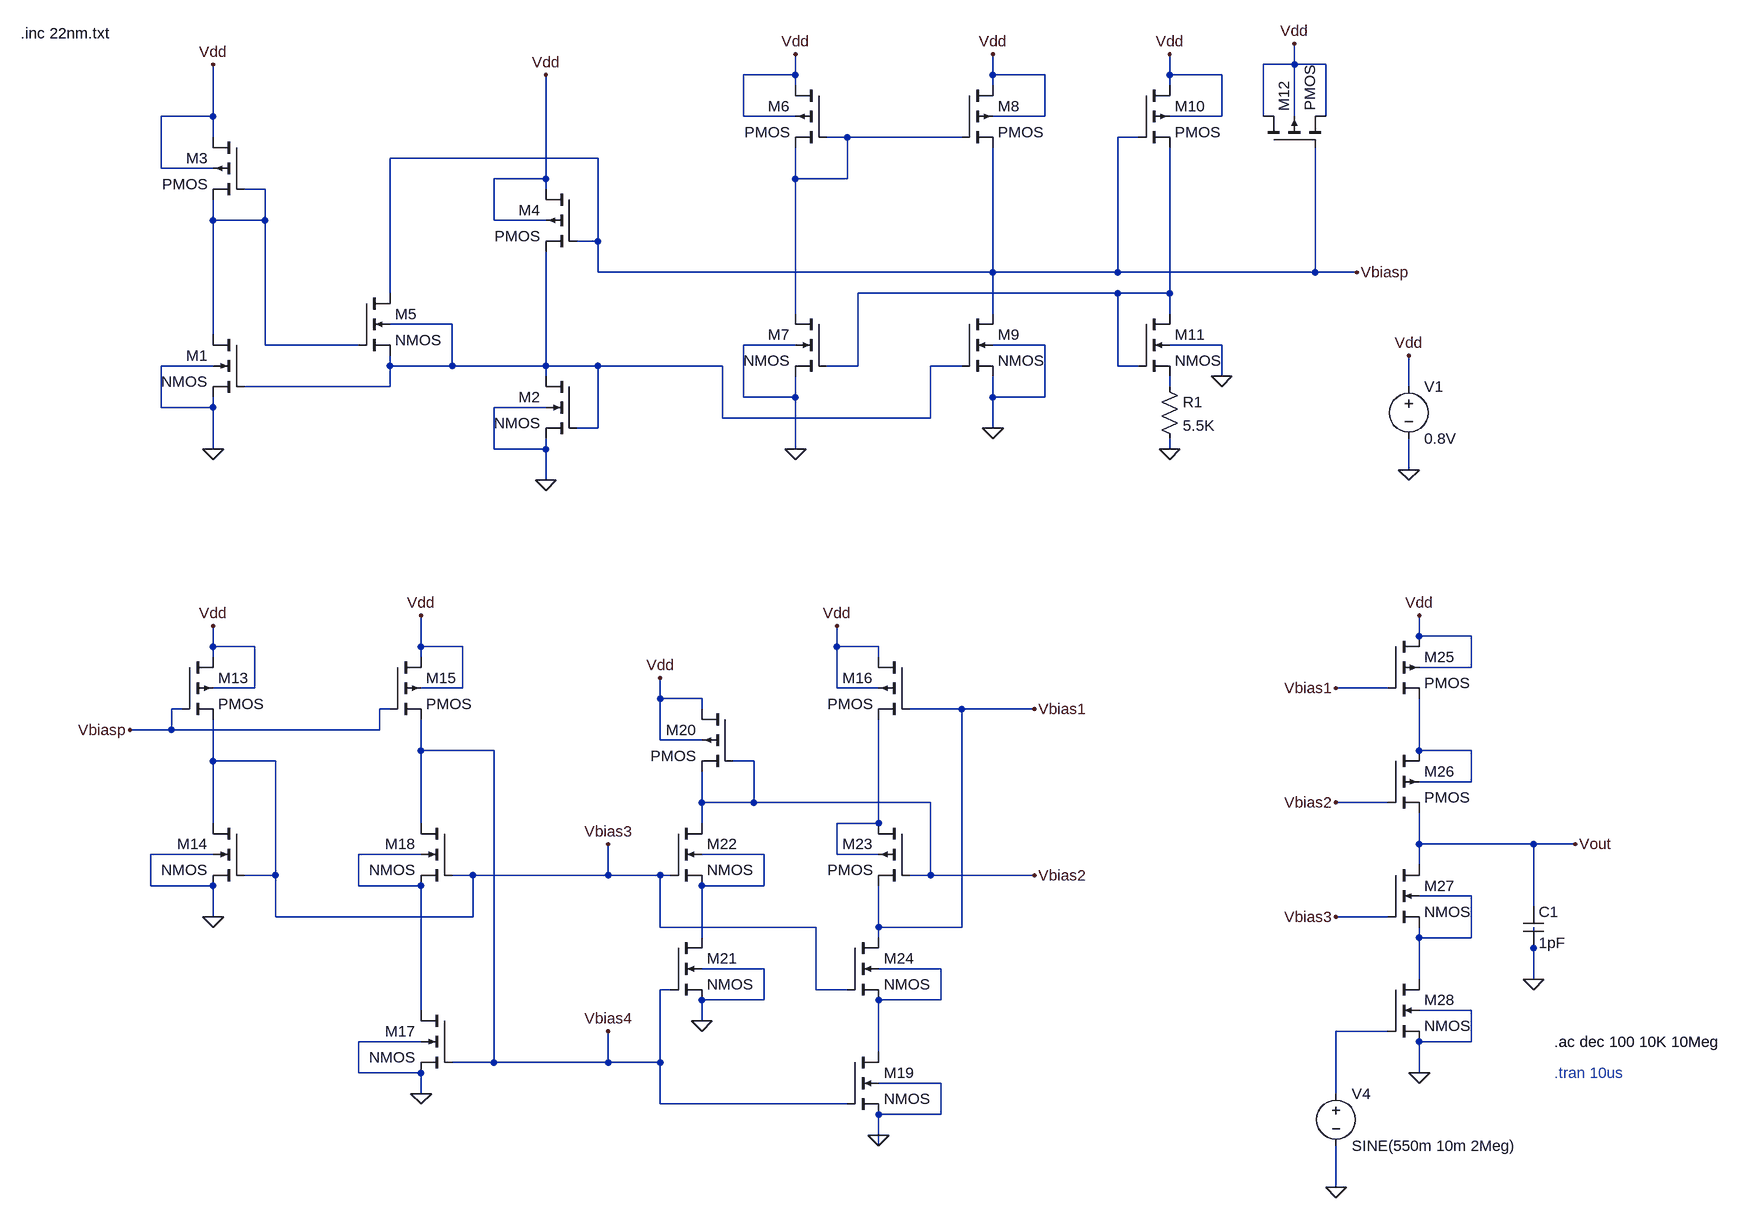
[diagram p0: schematic 22nm_schematic.asc]
22nm_schematic.asc, the LTspice schematic file:
Version 4
SHEET 1 2888 1620
WIRE -864 -128 -864 -160
WIRE -864 -128 -912 -128
WIRE -816 -128 -864 -128
WIRE -1632 -112 -1632 -144
WIRE -1632 -112 -1712 -112
WIRE -1328 -112 -1328 -144
WIRE -1248 -112 -1328 -112
WIRE -1056 -112 -1056 -144
WIRE -976 -112 -1056 -112
WIRE -1632 -96 -1632 -112
WIRE -1328 -96 -1328 -112
WIRE -1056 -96 -1056 -112
WIRE -2528 -48 -2528 -128
WIRE -2528 -48 -2608 -48
WIRE -1712 -48 -1712 -112
WIRE -1632 -48 -1712 -48
WIRE -1248 -48 -1248 -112
WIRE -1248 -48 -1328 -48
WIRE -976 -48 -976 -112
WIRE -976 -48 -1056 -48
WIRE -912 -48 -912 -128
WIRE -864 -48 -864 -128
WIRE -816 -48 -816 -128
WIRE -2528 -16 -2528 -48
WIRE -1552 -16 -1584 -16
WIRE -1376 -16 -1552 -16
WIRE -1104 -16 -1136 -16
WIRE -1936 16 -2256 16
WIRE -2608 32 -2608 -48
WIRE -2528 32 -2608 32
WIRE -2016 48 -2016 -112
WIRE -2016 48 -2096 48
WIRE -1632 48 -1632 0
WIRE -1552 48 -1552 -16
WIRE -1552 48 -1632 48
WIRE -2448 64 -2480 64
WIRE -2016 64 -2016 48
WIRE -2528 112 -2528 80
WIRE -2448 112 -2448 64
WIRE -2448 112 -2528 112
WIRE -2096 112 -2096 48
WIRE -2016 112 -2096 112
WIRE -1936 144 -1936 16
WIRE -1936 144 -1968 144
WIRE -1936 192 -1936 144
WIRE -1328 192 -1328 0
WIRE -1328 192 -1936 192
WIRE -1136 192 -1136 -16
WIRE -1136 192 -1328 192
WIRE -832 192 -832 0
WIRE -832 192 -1136 192
WIRE -768 192 -832 192
WIRE -2256 224 -2256 16
WIRE -1136 224 -1536 224
WIRE -1056 224 -1056 0
WIRE -1056 224 -1136 224
WIRE -1632 256 -1632 48
WIRE -1328 256 -1328 192
WIRE -1056 256 -1056 224
WIRE -2160 272 -2256 272
WIRE -2528 288 -2528 112
WIRE -2448 304 -2448 112
WIRE -2304 304 -2448 304
WIRE -1632 304 -1712 304
WIRE -1248 304 -1328 304
WIRE -976 304 -1056 304
WIRE -2528 336 -2608 336
WIRE -2256 336 -2256 320
WIRE -2160 336 -2160 272
WIRE -2160 336 -2256 336
WIRE -2016 336 -2016 160
WIRE -2016 336 -2160 336
WIRE -1936 336 -2016 336
WIRE -1744 336 -1936 336
WIRE -1536 336 -1536 224
WIRE -1536 336 -1584 336
WIRE -1376 336 -1424 336
WIRE -1136 336 -1136 224
WIRE -1104 336 -1136 336
WIRE -2016 352 -2016 336
WIRE -976 352 -976 304
WIRE -2256 368 -2256 336
WIRE -2256 368 -2480 368
WIRE -1056 368 -1056 352
WIRE -688 368 -688 320
WIRE -1712 384 -1712 304
WIRE -1632 384 -1632 352
WIRE -1632 384 -1712 384
WIRE -1328 384 -1328 352
WIRE -1248 384 -1248 304
WIRE -1248 384 -1328 384
WIRE -2608 400 -2608 336
WIRE -2528 400 -2528 384
WIRE -2528 400 -2608 400
WIRE -2016 400 -2096 400
WIRE -1744 416 -1744 336
WIRE -1424 416 -1424 336
WIRE -1424 416 -1744 416
WIRE -1936 432 -1936 336
WIRE -1936 432 -1968 432
WIRE -1328 432 -1328 384
WIRE -2528 464 -2528 400
WIRE -2096 464 -2096 400
WIRE -2016 464 -2016 448
WIRE -2016 464 -2096 464
WIRE -1632 464 -1632 384
WIRE -1056 464 -1056 448
WIRE -688 496 -688 448
WIRE -2016 512 -2016 464
WIRE -672 752 -672 720
WIRE -592 752 -672 752
WIRE -2528 768 -2528 736
WIRE -2464 768 -2528 768
WIRE -2208 768 -2208 720
WIRE -2144 768 -2208 768
WIRE -1568 768 -1568 736
WIRE -1504 768 -1568 768
WIRE -2528 784 -2528 768
WIRE -2208 784 -2208 768
WIRE -1504 784 -1504 768
WIRE -592 800 -592 752
WIRE -592 800 -672 800
WIRE -2464 832 -2464 768
WIRE -2464 832 -2528 832
WIRE -2144 832 -2144 768
WIRE -2144 832 -2208 832
WIRE -1568 832 -1568 768
WIRE -1504 832 -1568 832
WIRE -720 832 -800 832
WIRE -1840 848 -1840 816
WIRE -1776 848 -1840 848
WIRE -2576 864 -2592 864
WIRE -2256 864 -2272 864
WIRE -1776 864 -1776 848
WIRE -1376 864 -1456 864
WIRE -1264 864 -1376 864
WIRE -2592 896 -2592 864
WIRE -2592 896 -2656 896
WIRE -2272 896 -2272 864
WIRE -2272 896 -2592 896
WIRE -1840 912 -1840 848
WIRE -1776 912 -1840 912
WIRE -2208 928 -2208 880
WIRE -2096 928 -2208 928
WIRE -672 928 -672 848
WIRE -592 928 -672 928
WIRE -2528 944 -2528 880
WIRE -2432 944 -2528 944
WIRE -1696 944 -1728 944
WIRE -592 976 -592 928
WIRE -592 976 -672 976
WIRE -1776 1008 -1776 960
WIRE -1696 1008 -1696 944
WIRE -1696 1008 -1776 1008
WIRE -1424 1008 -1696 1008
WIRE -720 1008 -800 1008
WIRE -2528 1040 -2528 944
WIRE -2208 1040 -2208 928
WIRE -1776 1040 -1776 1008
WIRE -1504 1040 -1504 880
WIRE -1504 1040 -1568 1040
WIRE -672 1072 -672 1024
WIRE -496 1072 -672 1072
WIRE -432 1072 -496 1072
WIRE -2528 1088 -2624 1088
WIRE -2208 1088 -2304 1088
WIRE -1680 1088 -1776 1088
WIRE -1568 1088 -1568 1040
WIRE -1504 1088 -1568 1088
WIRE -672 1104 -672 1072
WIRE -2432 1120 -2432 944
WIRE -2432 1120 -2480 1120
WIRE -2128 1120 -2160 1120
WIRE -1920 1120 -1920 1072
WIRE -1920 1120 -2128 1120
WIRE -1840 1120 -1920 1120
WIRE -1824 1120 -1840 1120
WIRE -1424 1120 -1424 1008
WIRE -1424 1120 -1456 1120
WIRE -1264 1120 -1424 1120
WIRE -2624 1136 -2624 1088
WIRE -2528 1136 -2624 1136
WIRE -2304 1136 -2304 1088
WIRE -2208 1136 -2304 1136
WIRE -1680 1136 -1680 1088
WIRE -1680 1136 -1776 1136
WIRE -592 1152 -672 1152
WIRE -496 1168 -496 1072
WIRE -2528 1184 -2528 1136
WIRE -2432 1184 -2432 1120
WIRE -2128 1184 -2128 1120
WIRE -2128 1184 -2432 1184
WIRE -720 1184 -800 1184
WIRE -1840 1200 -1840 1120
WIRE -1600 1200 -1840 1200
WIRE -1504 1200 -1504 1136
WIRE -1376 1200 -1376 864
WIRE -1376 1200 -1504 1200
WIRE -1776 1216 -1776 1136
WIRE -1504 1216 -1504 1200
WIRE -672 1216 -672 1200
WIRE -592 1216 -592 1152
WIRE -592 1216 -672 1216
WIRE -496 1232 -496 1200
WIRE -1680 1264 -1776 1264
WIRE -1408 1264 -1504 1264
WIRE -672 1280 -672 1216
WIRE -496 1280 -496 1232
WIRE -1824 1296 -1840 1296
WIRE -1600 1296 -1600 1200
WIRE -1552 1296 -1600 1296
WIRE -1680 1312 -1680 1264
WIRE -1680 1312 -1776 1312
WIRE -1408 1312 -1408 1264
WIRE -1408 1312 -1504 1312
WIRE -2208 1328 -2208 1136
WIRE -592 1328 -672 1328
WIRE -1776 1344 -1776 1312
WIRE -720 1360 -800 1360
WIRE -2208 1376 -2304 1376
WIRE -672 1376 -672 1360
WIRE -592 1376 -592 1328
WIRE -592 1376 -672 1376
WIRE -1504 1392 -1504 1312
WIRE -2096 1408 -2096 928
WIRE -2096 1408 -2160 1408
WIRE -1920 1408 -1920 1360
WIRE -1920 1408 -2096 1408
WIRE -1840 1408 -1840 1296
WIRE -1840 1408 -1920 1408
WIRE -2304 1424 -2304 1376
WIRE -2208 1424 -2304 1424
WIRE -672 1424 -672 1376
WIRE -1408 1440 -1504 1440
WIRE -2208 1456 -2208 1424
WIRE -800 1456 -800 1360
WIRE -1840 1472 -1840 1408
WIRE -1552 1472 -1840 1472
WIRE -1408 1488 -1408 1440
WIRE -1408 1488 -1504 1488
WIRE -1504 1520 -1504 1488
WIRE -1504 1536 -1504 1520
WIRE -800 1600 -800 1536
FLAG -2016 512 0
FLAG -2656 896 Vbiasp
FLAG -1264 864 Vbias1
FLAG -1264 1120 Vbias2
FLAG -800 832 Vbias1
FLAG -800 1008 Vbias2
FLAG -800 1184 Vbias3
FLAG -432 1072 Vout
FLAG -976 352 0
FLAG -688 496 0
FLAG -1056 464 0
FLAG -1632 464 0
FLAG -2528 464 0
FLAG -688 320 Vdd
FLAG -864 -160 Vdd
FLAG -1056 -144 Vdd
FLAG -1328 -144 Vdd
FLAG -1632 -144 Vdd
FLAG -2016 -112 Vdd
FLAG -2528 -128 Vdd
FLAG -1328 432 0
FLAG -672 720 Vdd
FLAG -2528 1184 0
FLAG -2208 1456 0
FLAG -1776 1344 0
FLAG -1504 1520 0
FLAG -2528 736 Vdd
FLAG -2208 720 Vdd
FLAG -1840 816 Vdd
FLAG -1568 736 Vdd
FLAG -768 192 Vbiasp
FLAG -496 1280 0
FLAG -672 1424 0
FLAG -800 1600 0
FLAG -1920 1072 Vbias3
FLAG -1920 1360 Vbias4
SYMBOL nmos4 -2480 288 M0
SYMATTR InstName M1
SYMATTR Value2 l=44n w=220n
SYMBOL nmos4 -1968 352 M0
SYMATTR InstName M2
SYMATTR Value2 l=44n w=220n
SYMBOL pmos4 -2480 -16 M0
SYMATTR InstName M3
SYMATTR Value2 l=440n w=220n
SYMBOL pmos4 -1968 64 M0
SYMATTR InstName M4
SYMATTR Value2 l=44n w=528n
SYMBOL nmos4 -2304 224 R0
SYMATTR InstName M5
SYMATTR Value2 l=44n w=88n
SYMBOL pmos4 -1584 -96 M0
SYMATTR InstName M6
SYMATTR Value2 l=44n w=528n
SYMBOL nmos4 -1584 256 M0
SYMATTR InstName M7
SYMATTR Value2 l=44n w=220n
SYMBOL pmos4 -1376 -96 R0
SYMATTR InstName M8
SYMATTR Value2 l=44n w=528n
SYMBOL nmos4 -1376 256 R0
SYMATTR InstName M9
SYMATTR Value2 l=44n w=220n
SYMBOL pmos4 -1104 -96 R0
SYMATTR InstName M10
SYMATTR Value2 l=44n w=528n
SYMBOL nmos4 -1104 256 R0
SYMATTR InstName M11
SYMATTR Value2 l=44n w=660n
SYMBOL res -1072 352 R0
SYMATTR InstName R1
SYMATTR Value 5.5K
SYMBOL pmos4 -912 0 R270
SYMATTR InstName M12
SYMATTR Value2 l=1100n w=1100n
SYMBOL pmos4 -2576 784 R0
SYMATTR InstName M13
SYMATTR Value2 l=44n w=528n
SYMBOL nmos4 -2480 1040 M0
SYMATTR InstName M14
SYMATTR Value2 l=44n w=110n
SYMBOL pmos4 -2256 784 R0
SYMATTR InstName M15
SYMATTR Value2 l=44n w=528n
SYMBOL pmos4 -1456 784 M0
SYMATTR InstName M16
SYMATTR Value2 l=44n w=528n
SYMBOL nmos4 -2160 1328 M0
SYMATTR InstName M17
SYMATTR Value2 l=44n w=220n
SYMBOL nmos4 -2160 1040 M0
SYMATTR InstName M18
SYMATTR Value2 l=44n w=220n
SYMBOL nmos4 -1552 1392 R0
SYMATTR InstName M19
SYMATTR Value2 l=44n w=220n
SYMBOL pmos4 -1728 864 M0
SYMATTR InstName M20
SYMATTR Value2 l=110n w=440n
SYMBOL nmos4 -1824 1216 R0
SYMATTR InstName M21
SYMATTR Value2 l=44n w=220n
SYMBOL nmos4 -1824 1040 R0
SYMATTR InstName M22
SYMATTR Value2 l=44n w=220n
SYMBOL pmos4 -1456 1040 M0
SYMATTR InstName M23
SYMATTR Value2 l=44n w=528n
SYMBOL nmos4 -1552 1216 R0
SYMATTR InstName M24
SYMATTR Value2 l=44n w=220n
SYMBOL pmos4 -720 752 R0
SYMATTR InstName M25
SYMATTR Value2 l=22n w=550n
SYMBOL pmos4 -720 928 R0
SYMATTR InstName M26
SYMATTR Value2 l=22n w=550n
SYMBOL nmos4 -720 1104 R0
SYMATTR InstName M27
SYMATTR Value2 l=22n w=275n
SYMBOL nmos4 -720 1280 R0
SYMATTR InstName M28
SYMATTR Value2 l=22n w=275n
SYMBOL voltage -800 1440 R0
WINDOW 39 0 0 Left 0
SYMATTR Value2 AC 6.9 0
SYMATTR InstName V4
SYMATTR Value SINE(550m 10m 2Meg)
SYMBOL voltage -688 352 R0
WINDOW 123 0 0 Left 0
WINDOW 39 0 0 Left 0
SYMATTR InstName V1
SYMATTR Value 0.8V
SYMBOL cap -512 1168 R0
SYMATTR InstName C1
SYMATTR Value 1pF
TEXT -2824 -176 Left 2 !.inc 22nm.txt
TEXT -464 1376 Left 2 !.ac dec 100 10K 10Meg
TEXT -464 1424 Left 2 ;.tran 10us

The netlist it stands for:
* 22nm_schematic.asc
M1 N002 N004 0 0 NMOS l=44n w=220n
M2 N004 N004 0 0 NMOS l=44n w=220n
M3 Vdd N002 N002 Vdd PMOS l=440n w=220n
M4 Vdd Vbiasp N004 Vdd PMOS l=44n w=528n
M5 Vbiasp N002 N004 N004 NMOS l=44n w=88n
M6 Vdd N001 N001 Vdd PMOS l=44n w=528n
M7 N001 N003 0 0 NMOS l=44n w=220n
M8 Vdd N001 Vbiasp Vdd PMOS l=44n w=528n
M9 Vbiasp N004 0 0 NMOS l=44n w=220n
M10 Vdd Vbiasp N003 Vdd PMOS l=44n w=528n
M11 N003 N003 N005 0 NMOS l=44n w=660n
R1 N005 0 5.5K
M12 Vdd Vbiasp Vdd Vdd PMOS l=1100n w=1100n
M13 Vdd Vbiasp Vbias3 Vdd PMOS l=44n w=528n
M14 Vbias3 Vbias3 0 0 NMOS l=44n w=110n
M15 Vdd Vbiasp Vbias4 Vdd PMOS l=44n w=528n
M16 Vdd Vbias1 N007 Vdd PMOS l=44n w=528n
M17 N008 Vbias4 0 0 NMOS l=44n w=220n
M18 Vbias4 Vbias3 N008 N008 NMOS l=44n w=220n
M19 N011 Vbias4 0 0 NMOS l=44n w=220n
M20 Vdd Vbias2 Vbias2 Vdd PMOS l=110n w=440n
M21 N009 Vbias4 0 0 NMOS l=44n w=220n
M22 Vbias2 Vbias3 N009 N009 NMOS l=44n w=220n
M23 N007 Vbias2 Vbias1 N007 PMOS l=44n w=528n
M24 Vbias1 Vbias3 N011 N011 NMOS l=44n w=220n
M25 Vdd Vbias1 N006 Vdd PMOS l=22n w=550n
M26 N006 Vbias2 Vout N006 PMOS l=22n w=550n
M27 Vout Vbias3 N010 N010 NMOS l=22n w=275n
M28 N010 N012 0 0 NMOS l=22n w=275n
V4 N012 0 SINE(550m 10m 2Meg) AC 6.9 0
V1 Vdd 0 0.8V
C1 Vout 0 1pF
.model NMOS NMOS
.model PMOS PMOS
.lib standard.mos
.inc 22nm.txt
.ac dec 100 10K 10Meg
* .tran 10us
.backanno
.end